# Altium project reciever.PrjPcb
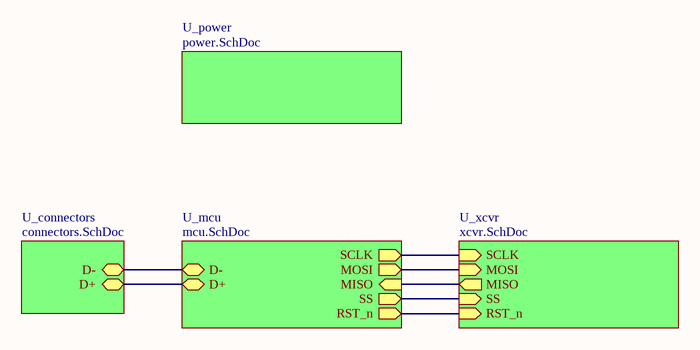
[diagram p0: reciever.SchDoc]
3 sheets, 21 parts. Net scope: hierarchical (ports join the sheet entries above them; power ports are global).
Board file: reciever.PcbDoc
Sheets:
  reciever.SchDoc
    U_power = power.SchDoc
    U_xcvr = xcvr.SchDoc

## Sheet reciever.SchDoc
size A

### Sub-sheets
U_connectors = connectors.SchDoc (file not in this document): D- (bidir), D+ (bidir)
U_mcu = mcu.SchDoc (file not in this document): SCLK (out), MOSI (out), MISO (in), SS (out), D- (bidir), D+ (bidir), RST_n (out)
U_power = power.SchDoc: no entries
U_xcvr = xcvr.SchDoc: SCLK (in), MOSI (in), MISO (out), SS (in), RST_n (in)

### Nets
NetR3_1: sheet U_mcu/RST_n, sheet U_xcvr/RST_n
NetXCVR_13: sheet U_mcu/SS, sheet U_xcvr/SS
NetXCVR_15: sheet U_mcu/SCLK, sheet U_xcvr/SCLK
NetXCVR_16: sheet U_mcu/MOSI, sheet U_xcvr/MOSI
NetXCVR_17: sheet U_mcu/MISO, sheet U_xcvr/MISO
(unnamed): sheet U_mcu/D-, sheet U_connectors/D-
(unnamed): sheet U_mcu/D+, sheet U_connectors/D+

## Sheet power.SchDoc
size A
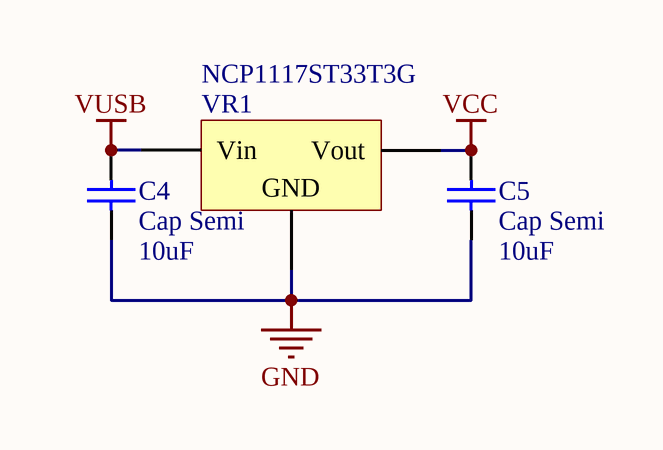
[diagram p1: power.SchDoc]

### Parts
C4  Cap Semi  value 10uF  [CAPC1608L]
C5  Cap Semi  value 10uF  [CAPC1608L]
VR1  NCP1117ST33T3G  [SOT223-4N]

### Nets
GND: C4.1 C5.1 VR1.2(GND)
VCC: C5.2 VR1.3(Vout)
VUSB: C4.2 VR1.1(Vin)

### Library data of the parts
C4 C5 = Cap Semi: Capacitor (Semiconductor SIM Model); Published: 8-Jun-2000; LatestRevisionDate: 29-May-2009; LatestRevisionNote: IPC-7351 Footprint Added.; PackageReference: C1206; Publisher: Altium Limited; PackageDescription: Chip Capacitor
VR1 = Volt Reg: Voltage Regulator; Published: 24-Mar-1999; LatestRevisionDate: 29-May-2009; LatestRevisionNote: IPC-7351 Footprint Added.; PackageReference: D2PAK; Publisher: Altium Limited; PackageDescription: 3-Pin Transistor Outline Package 2.54 mm Pitch, 15.1 mm Lead Span

## Sheet xcvr.SchDoc
size A
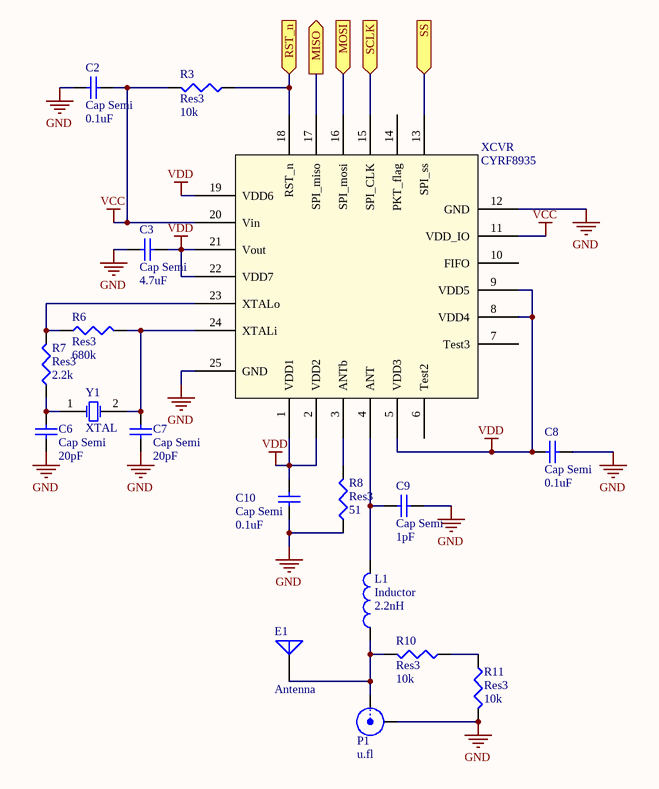
[diagram p2: xcvr.SchDoc]

### Parts
C2  Cap Semi  value 0.1uF  [CAPC1608L]
C3  Cap Semi  value 4.7uF  [CAPC1608L]
C6  Cap Semi  value 20pF  [CAPC1608L]
C7  Cap Semi  value 20pF  [CAPC1608L]
C8  Cap Semi  value 0.1uF  [CAPC1608L]
C9  Cap Semi  value 1pF  [CAPC1608L]
C10  Cap Semi  value 0.1uF  [CAPC1608L]
E1  Antenna  [PIN1]
L1  Inductor  value 2.2nH  [INDC1608L]
P1  u.fl  [U.FL connector]
R3  Res3  value 10k  [RESC1608L]
R6  Res3  value 680k  [RESC1608L]
R7  Res3  value 2.2k  [RESC1608L]
R8  Res3  value 51  [RESC1608L]
R10  Res3  value 10k  [RESC1608L]
R11  Res3  value 10k  [RESC1608L]
XCVR  CYRF8935  [QFN50P400X400-24VAL]
Y1  XTAL  [PCBComponent_1]

### Ports
MISO (out), MOSI (in), RST_n (in), SCLK (in), SS (in)

### Nets
GND: C2.1 C3.1 C6.1 C7.1 C8.1 C9.2 C10.2 P1.2(Y) R8.1 R11.2 XCVR.12(GND) XCVR.25(GND)
VCC: C2.2 R3.2 XCVR.11(VDD_IO) XCVR.20(Vin)
VDD: C3.2 C8.2 C10.1 XCVR.1(VDD1) XCVR.2(VDD2) XCVR.5(VDD3) XCVR.8(VDD4) XCVR.9(VDD5) XCVR.19(VDD6) XCVR.21(Vout) XCVR.22(VDD7)
NetC6_2: C6.2 R7.1 Y1.1(OSC1)
NetC7_2: C7.2 R6.2 XCVR.24(XTALi) Y1.2(OSC2)
NetC9_1: C9.1 L1.2 XCVR.4(ANT)
NetE1_1: E1.1(A) L1.1 P1.1(X) R10.2
NetR3_1: R3.1 XCVR.18(RST_n) ; port RST_n
NetR6_1: R6.1 R7.2 XCVR.23(XTALo)
NetR8_2: R8.2 XCVR.3(ANTb)
NetR10_1: R10.1 R11.1
NetXCVR_13: XCVR.13(SPI_ss) ; port SS
NetXCVR_15: XCVR.15(SPI_CLK) ; port SCLK
NetXCVR_16: XCVR.16(SPI_mosi) ; port MOSI
NetXCVR_17: XCVR.17(SPI_miso) ; port MISO

Not connected (* = marked no-connect by the designer): XCVR 6(Test2) 7(Test3) 10(FIFO) 14(PKT_flag)

### Library data of the parts
C2 C3 C6-C10 = Cap Semi: Capacitor (Semiconductor SIM Model); Published: 8-Jun-2000; LatestRevisionDate: 29-May-2009; LatestRevisionNote: IPC-7351 Footprint Added.; PackageReference: C1206; Publisher: Altium Limited; PackageDescription: Chip Capacitor
E1 = Antenna: Generic Antenna; Published: 24-Mar-1999; LatestRevisionDate: 17-Jul-2002; LatestRevisionNote: Re-released for DXP Platform.; PackageReference: PIN1; Publisher: Altium Limited
L1 = Inductor: Code_IEC: 1005; Published: 8-Jun-2000; LatestRevisionDate: 29-May-2009; LatestRevisionNote: IPC-7351 Footprint Added.; PackageReference: 0402-A; Publisher: Altium Limited; PackageDescription: Chip Inductor; Code_JEITA: 0402
P1 = BNC: BNC Elbow Connector; LatestRevisionDate: 17-Jul-2002; LatestRevisionNote: Re-released for DXP Platform.; Publisher: Altium Limited
R3 R6-R8 R10 R11 = Res3: Resistor; Published: 8-Jun-2000; LatestRevisionDate: 29-May-2009; LatestRevisionNote: IPC-7351 Footprint Added.; PackageReference: J1-0603; Publisher: Altium Limited; PackageDescription: Chip Resistor
Y1 = XTAL: Crystal Oscillator; Published: 8-Jun-2000; LatestRevisionDate: 17-Jul-2002; LatestRevisionNote: Re-released for DXP Platform.; PackageReference: R38; Publisher: Altium Limited

## Nets that join several sheets
GND: power (C4.1 C5.1 VR1.2), xcvr (12 pins)
VCC: power (C5.2 VR1.3), xcvr (C2.2 R3.2 XCVR.11 XCVR.20)